# EAGLE design Group11 (EAGLE 9.2.0)
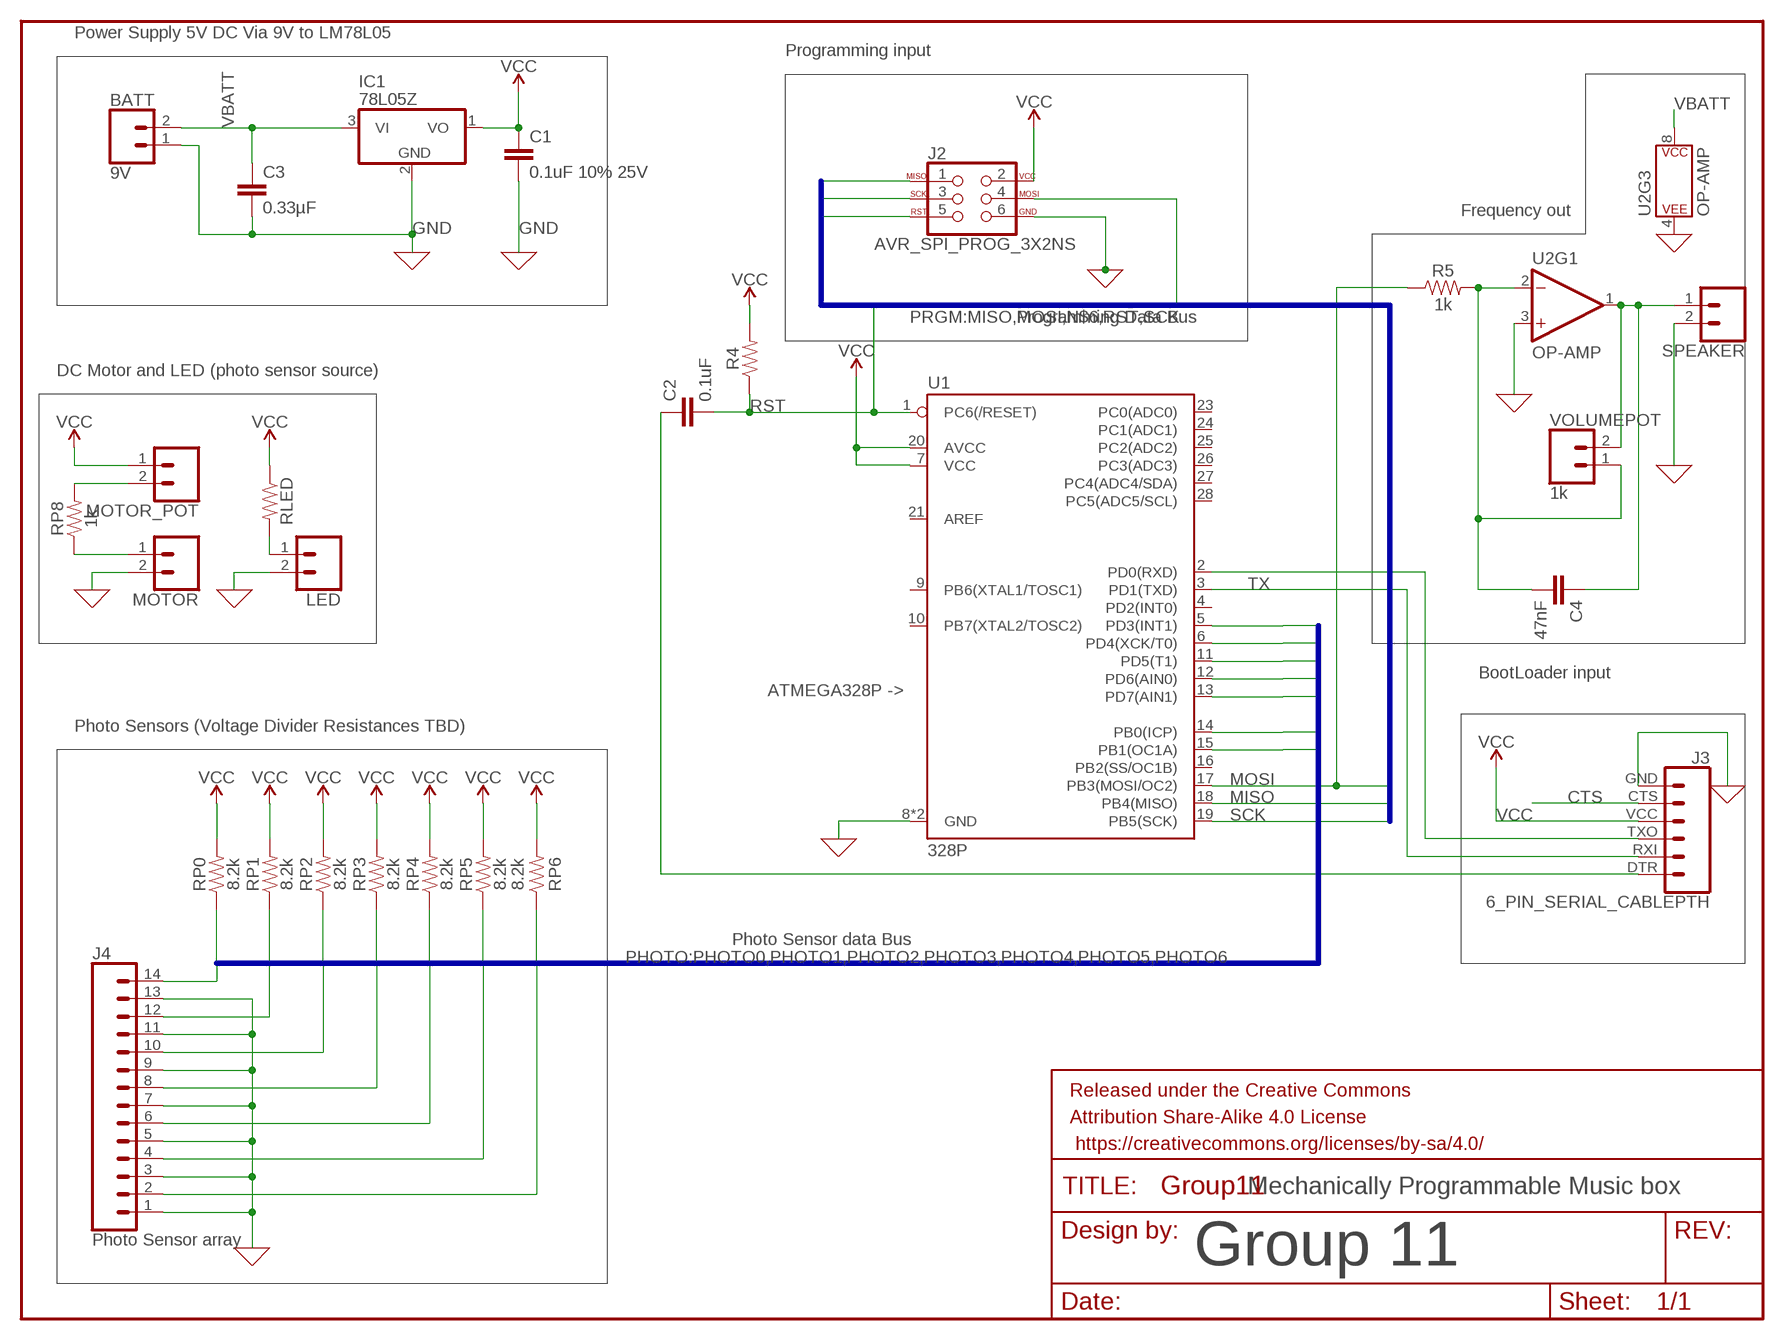
[diagram p0: schematic, sheet 1]

## Parts
BATT  9V  CONN_02  [1X02]
C1  0.1uF 10% 25V  0.1UF-0603-25V-(+80/-20%)  [0603]
C2  0.1uF  0.1UF-0603-25V-(+80/-20%)  [0603]
C3  0.33µF  0.33UF/330NF-0805-50V-10%  [0805]
C4  47nF  47NF-0603-25V-5%  [0603]
FRAME1  FRAME-LETTER  [CREATIVE_COMMONS]
IC1  78L05Z  [TO92]
J2  AVR_SPI_PROG_3X2NS  [2X3-NS]
J3  6_PIN_SERIAL_CABLEPTH  [FTDI_BASIC]
J4  Photo Sensor array  CONN_14  [1X14]
LED  CONN_02  [1X02]
MOTOR  CONN_02  [1X02]
MOTOR_POT  CONN_02  [1X02]
R4  RESISTOR0805  [0805]
R5  1k  1KOHM-0603-1/10W-1%  [0603]
RLED  RESISTOR0603  [0603]
RP0  8.2k  RESISTOR0603  [0603]
RP1  8.2k  RESISTOR0603  [0603]
RP2  8.2k  RESISTOR0603  [0603]
RP3  8.2k  RESISTOR0603  [0603]
RP4  8.2k  RESISTOR0603  [0603]
RP5  8.2k  RESISTOR0603  [0603]
RP6  8.2k  RESISTOR0603  [0603]
RP8  1k  RESISTOR0603  [0603]
SPEAKER  CONN_02  [1X02]
U1  328P  ATMEGA328P_PDIP  [DIP28]
U2  OP-AMP  OPAMP-DUALDIP  [DIP08]
VOLUMEPOT  1k  CONN_02  [1X02]

## Nets
CTS: J3.CTS
GND: BATT.1 C1.2 C3.2 IC1.2(GND) J2.6 J3.GND J4.1 J4.3 J4.5 J4.7 J4.9 J4.11 J4.13 LED.2 MOTOR.2 SPEAKER.2 U1.8(GND) U1.22(GND) U2.3(+IN) U2.4(P$V-)
MISO: J2.1 U1.18(PB4(MISO))
MOSI: J2.4 R5.1 U1.17(PB3(MOSI/OC2))
N$2: MOTOR_POT.2 RP8.2
N$3: LED.1 RLED.2
N$4: J3.TXO U1.2(PD0(RXD))
N$5: C2.1 J3.DTR
N$7: MOTOR.1 RP8.1
N$8: C4.2 R5.2 U2.2(-IN) VOLUMEPOT.1
N$9: C4.1 SPEAKER.1 U2.1(OUT) VOLUMEPOT.2
PHOTO0: J4.14 RP0.1 U1.5(PD3(INT1))
PHOTO1: J4.12 RP1.1 U1.6(PD4(XCK/T0))
PHOTO2: J4.10 RP2.1 U1.11(PD5(T1))
PHOTO3: J4.8 RP3.1 U1.12(PD6(AIN0))
PHOTO4: J4.6 RP4.1 U1.13(PD7(AIN1))
PHOTO5: J4.4 RP5.1 U1.14(PB0(ICP))
PHOTO6: J4.2 RP6.1 U1.15(PB1(OC1A))
RST: C2.2 J2.5 R4.1 U1.1(PC6(/RESET))
SCK: J2.3 U1.19(PB5(SCK))
TX: J3.RXI U1.3(PD1(TXD))
VBATT: BATT.2 C3.1 IC1.3(VI) U2.8(P$V+)
VCC: C1.1 IC1.1(VO) J2.2 J3.VCC MOTOR_POT.1 R4.2 RLED.1 RP0.2 RP1.2 RP2.2 RP3.2 RP4.2 RP5.2 RP6.2 U1.7(VCC) U1.20(AVCC)
Unconnected: U1.4(PD2(INT0)) U1.9(PB6(XTAL1/TOSC1)) U1.10(PB7(XTAL2/TOSC2)) U1.16(PB2(SS/OC1B)) U1.21(AREF) U1.23(PC0(ADC0)) U1.24(PC1(ADC1)) U1.25(PC2(ADC2)) U1.26(PC3(ADC3)) U1.27(PC4(ADC4/SDA)) U1.28(PC5(ADC5/SCL)) U2.5(+IN) U2.6(-IN) U2.7(OUT)

## Buses
PRGM:MISO,MOSI,N$6,RST,SCK
PHOTO:PHOTO0,PHOTO1,PHOTO2,PHOTO3,PHOTO4,PHOTO5,PHOTO6

## Notes on the sheet
- Power Supply 5V DC Via 9V to LM78L05
- Programming input
- Frequency out
- Programming Data Bus
- DC Motor and LED (photo sensor source)
- BootLoader input
- ATMEGA328P ->
- Photo Sensors (Voltage Divider Resistances TBD)
- Photo Sensor data Bus
- Mechanically Programmable Music box
- Group 11

## Library data of the parts
BATT LED MOTOR MOTOR_POT SPEAKER VOLUMEPOT = SparkFun-Connectors:CONN_02: Multi connection point. Often used as Generic Header-pin footprint for 0.1 inch spaced/style header connections On any of the 0.1 inch spaced packages, you can populate with these: Break Away Headers - Straight <https://www.sparkfun.com/products/116> (PRT-00116) Break Away Male Headers - Right Angle <https://www.sparkfun.com/products/553> (PRT-00553) Female Headers <https://www.sparkfun.com/products/115> (PRT-00115) Break Away Headers - Machine Pin <https://www.sparkfun.com/products/117> (PRT-00117) Break Away Female Headers - Swiss Machine Pin <https://www.sparkfun.com/products/743> (PRT-00743) For SCREWTERMINALS and SPRING TERMINALS visit here: Screw Terimnals on SparkFun.com <https://www.sparkfun.com/search/results?term=Screw+Terminals> (5mm/3.5mm/2.54mm spacing) This device is also useful as a general connection point to wire up your design to another part of your project. Our various solder wires solder well into these plated through hole pads. Hook-Up Wire - Assortment (Stranded, 22 AWG) <https://www.sparkfun.com/products/11375> (PRT-11375) Hook-Up Wire - Assortment (Solid Core, 22 AWG) <https://www.sparkfun.com/products/11367> (PRT-11367) View the entire wire category on our website here <https://www.sparkfun.com/categories/141> Special notes: Molex polarized connector foot print use with: PRT-08233 with associated crimp pins and housings. 2.54_SCREWTERM for use with PRT-10571. 3.5mm Screw Terminal footprints for PRT-08084 5mm Screw Terminal footprints for use with PRT-08432
C1 = SparkFun-Capacitors:0.1UF: 0.1µF ceramic capacitors A capacitor is a passive two-terminal electrical component used to store electrical energy temporarily in an electric field.; PROD_ID: CAP-00810; VALUE: 0.1uF
C2 = SparkFun-Capacitors:0.1UF: 0.1µF ceramic capacitors A capacitor is a passive two-terminal electrical component used to store electrical energy temporarily in an electric field.; PROD_ID: CAP-00810
C3 = SparkFun-Capacitors:0.33UF/330NF: 0.33µF/330nF ceramic capacitors A capacitor is a passive two-terminal electrical component used to store electrical energy temporarily in an electric field.; PROD_ID: CAP-08469
C4 = SparkFun-Capacitors:47NF: 47nF ceramic capacitors A capacitor is a passive two-terminal electrical component used to store electrical energy temporarily in an electric field.; PROD_ID: CAP-08605
FRAME1 = SparkFun-Aesthetics:FRAME-LETTER: Schematic Frame - Letter Standard 8.5x11 US Letter frame
IC1 = linear:78*: Positive VOLTAGE REGULATOR Source: http://cache.national.com/ds/LM/LM78L05.pdf http://www.fairchildsemi.com/ds/LM/LM7805.pdf
J2 = SparkFun-Connectors:AVR_SPI_PROG_3X2: AVR ISP 6 Pin This is the reduced ISP connector for AVR programming. Common on Arduino. This footprint will take up less PCB space and can be used with a 10-pin to 6-pin adapter such as SKU: BOB-08508 **Special note about "TEST_POINT" package. The stop mask is on the top side, so if you want your programming test points to be on the bottom of your board, make sure to place this package on the bottom side of the board. This also ensure that the orientation to program from the bottom side will be correct. SparkFun Products: SparkFun ISP Pogo Adapter <https://www.sparkfun.com/products/11591> - NS Tiny AVR Programmer <https://www.sparkfun.com/products/11801> -PTH
J3 = SparkFun-Connectors:6_PIN_SERIAL_CABLE: 6-pin header connection for use with the "FTDI BASIC" pinout - CABLE SIDE. Also known as "Arduino Serial Program Header". This is used on a design to provide a 6-pin connection point for serial communication usually from a USB cable (D+/D-) to these headers (RX/TX). It also has the remaining pins necessary for programming in the Arduino evironment (DTR, GND, and sometimes VCC). Note, this device has "CABLE" in the name. It is intended to be used on a design that usually lives on the end of your USB cable and prvides the converter chip (FTDI232 or FTDI231x) to commnicate serial RX/TX. The "sister" device, named "TARGET" is inteneded to be used on a design that contains a target micro-controller that you wish to program. You can populate with some of these: Female Headers <https://www.sparkfun.com/products/115> (PRT-00115) For reference (or to suit your programming needs) check out these designs: SparkFun FTDI Basic Breakout - 5V <https://www.sparkfun.com/products/9716> (DEV-09716) SparkFun FTDI Basic Breakout - 3.3V <https://www.sparkfun.com/products/9873> (DEV-09873) SparkFun FTDI SmartBasic <https://www.sparkfun.com/products/12935> (DEV-12935) SparkFun Beefy 3 - FTDI Basic Breakout <https://www.sparkfun.com/products/13746> (DEV-13746)
J4 = SparkFun-Connectors:CONN_14: Multi connection point. Often used as Generic Header-pin footprint for 0.1 inch spaced/style header connections On any of the 0.1 inch spaced packages, you can populate with these: Break Away Headers - Straight <https://www.sparkfun.com/products/116> (PRT-00116) Break Away Male Headers - Right Angle <https://www.sparkfun.com/products/553> (PRT-00553) Female Headers <https://www.sparkfun.com/products/115> (PRT-00115) Break Away Headers - Machine Pin <https://www.sparkfun.com/products/117> (PRT-00117) Break Away Female Headers - Swiss Machine Pin <https://www.sparkfun.com/products/743> (PRT-00743) For SCREWTERMINALS and SPRING TERMINALS visit here: Screw Terimnals on SparkFun.com <https://www.sparkfun.com/search/results?term=Screw+Terminals> (5mm/3.5mm/2.54mm spacing) This device is also useful as a general connection point to wire up your design to another part of your project. Our various solder wires solder well into these plated through hole pads. Hook-Up Wire - Assortment (Stranded, 22 AWG) <https://www.sparkfun.com/products/11375> (PRT-11375) Hook-Up Wire - Assortment (Solid Core, 22 AWG) <https://www.sparkfun.com/products/11367> (PRT-11367) View the entire wire category on our website here <https://www.sparkfun.com/categories/141> Special notes: Molex polarized connector foot print use with SKU : PRT-08231 with associated crimp pins and housings. 1MM SMD Version SKU: PRT-10208 NOTES ON THE VARIANTS LOCK and LOCK_LONGPADS... This footprint was designed to help hold the alignment of a through-hole component (i.e. 6-pin header) while soldering it into place. You may notice that each hole has been shifted either up or down by 0.005 of an inch from it's more standard position (which is a perfectly straight line). This slight alteration caused the pins (the squares in the middle) to touch the edges of the holes. Because they are alternating, it causes a "brace" to hold the component in place. 0.005 has proven to be the perfect amount of "off-center" position when using our standard breakaway headers. Although looks a little odd when you look at the bare footprint, once you have a header in there, the alteration is very hard to notice. Also,if you push a header all the way into place, it is covered up entirely on the bottom side.
R4 RLED RP0 RP1-RP6 RP8 = SparkFun-Resistors:RESISTOR: Generic Resistor Package
R5 = SparkFun-Resistors:1KOHM: 1kΩ resistor A resistor is a passive two-terminal electrical component that implements electrical resistance as a circuit element. Resistors act to reduce current flow, and, at the same time, act to lower voltage levels within circuits. - Wikipedia; PROD_ID: RES-07856
U1 = SparkFun-IC-Microcontroller:ATMEGA328P_PDIP: Atmel 328P Through hole ATMEGA328P uC used in the Arduino 32kb flash, 1k EEPROM, 2k SRAM Datasheet <http://www.sparkfun.com/datasheets/Components/SMD/ATMega328.pdf> SparkFun Products Storefront component: AVR 28 Pin 20MHz 32K 6A/D - ATMega328P <https://www.sparkfun.com/products/9061> (COM-09061) SparkFun Simon Says - Through-Hole Soldering Kit <https://www.sparkfun.com/products/10547> (KIT-10547) SparkFun Learn to Solder - Simon Says <https://www.sparkfun.com/products/13708> (KIT-13708) SparkFun BigTime Watch Kit <https://www.sparkfun.com/products/11734> (KIT-11734) SparkFun ClockIt <https://www.sparkfun.com/products/10930> (KIT-10930) SparkFun Serial Enabled LCD Kit <https://www.sparkfun.com/products/10097> (LCD-10097) SparkFun Simon Tilts - Through Hole Soldering Kit <https://www.sparkfun.com/products/12634> (KIT-12634) SparkFun Frequency Counter Kit <https://www.sparkfun.com/products/10140> (KIT-10140) FabFM Radio Kit <https://www.sparkfun.com/products/11043> (KIT-11043) SparkFun Binary Blaster Kit <https://www.sparkfun.com/products/12037> (KIT-12037) SparkFun Metro-Gnome <https://www.sparkfun.com/products/9236> (KIT-09236) ATmega328 with Arduino Optiboot (Uno) <https://www.sparkfun.com/products/10524> (DEV-10524); PROD_ID: IC-09136
U2 = SparkFun-IC-Amplifiers:OPAMP-DUAL: Generic op-amp footprint This component is for the standard 358 pinning of a dual op-amp From the LM358 datasheet: Pin 1: Output A Pin 2: Inverting Input A Pin 3: Non-Inverting Input A Pin 4: Gnd Pin 5: Non-Inverting Input B Pin 6: Inverting Input B Pin 7: Output B Pin 8: V+; PROD_ID: NA-XXXXX

## Board
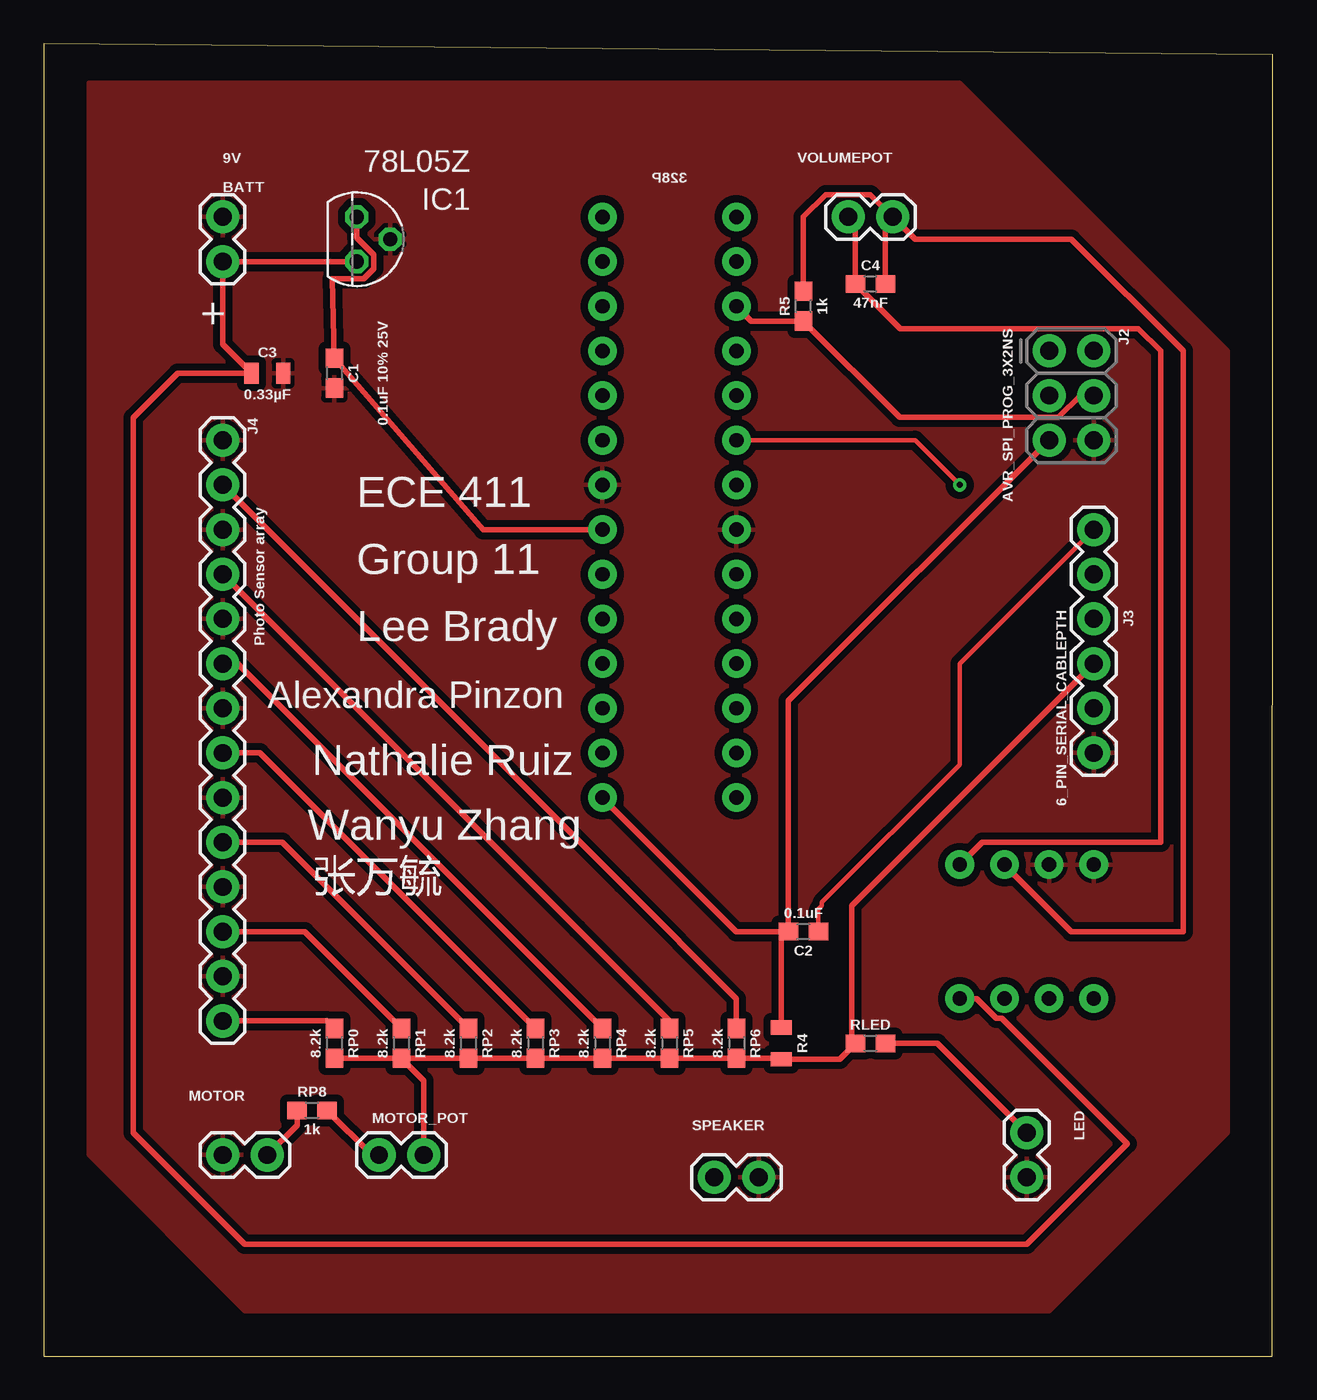
[diagram p1: board, top side]
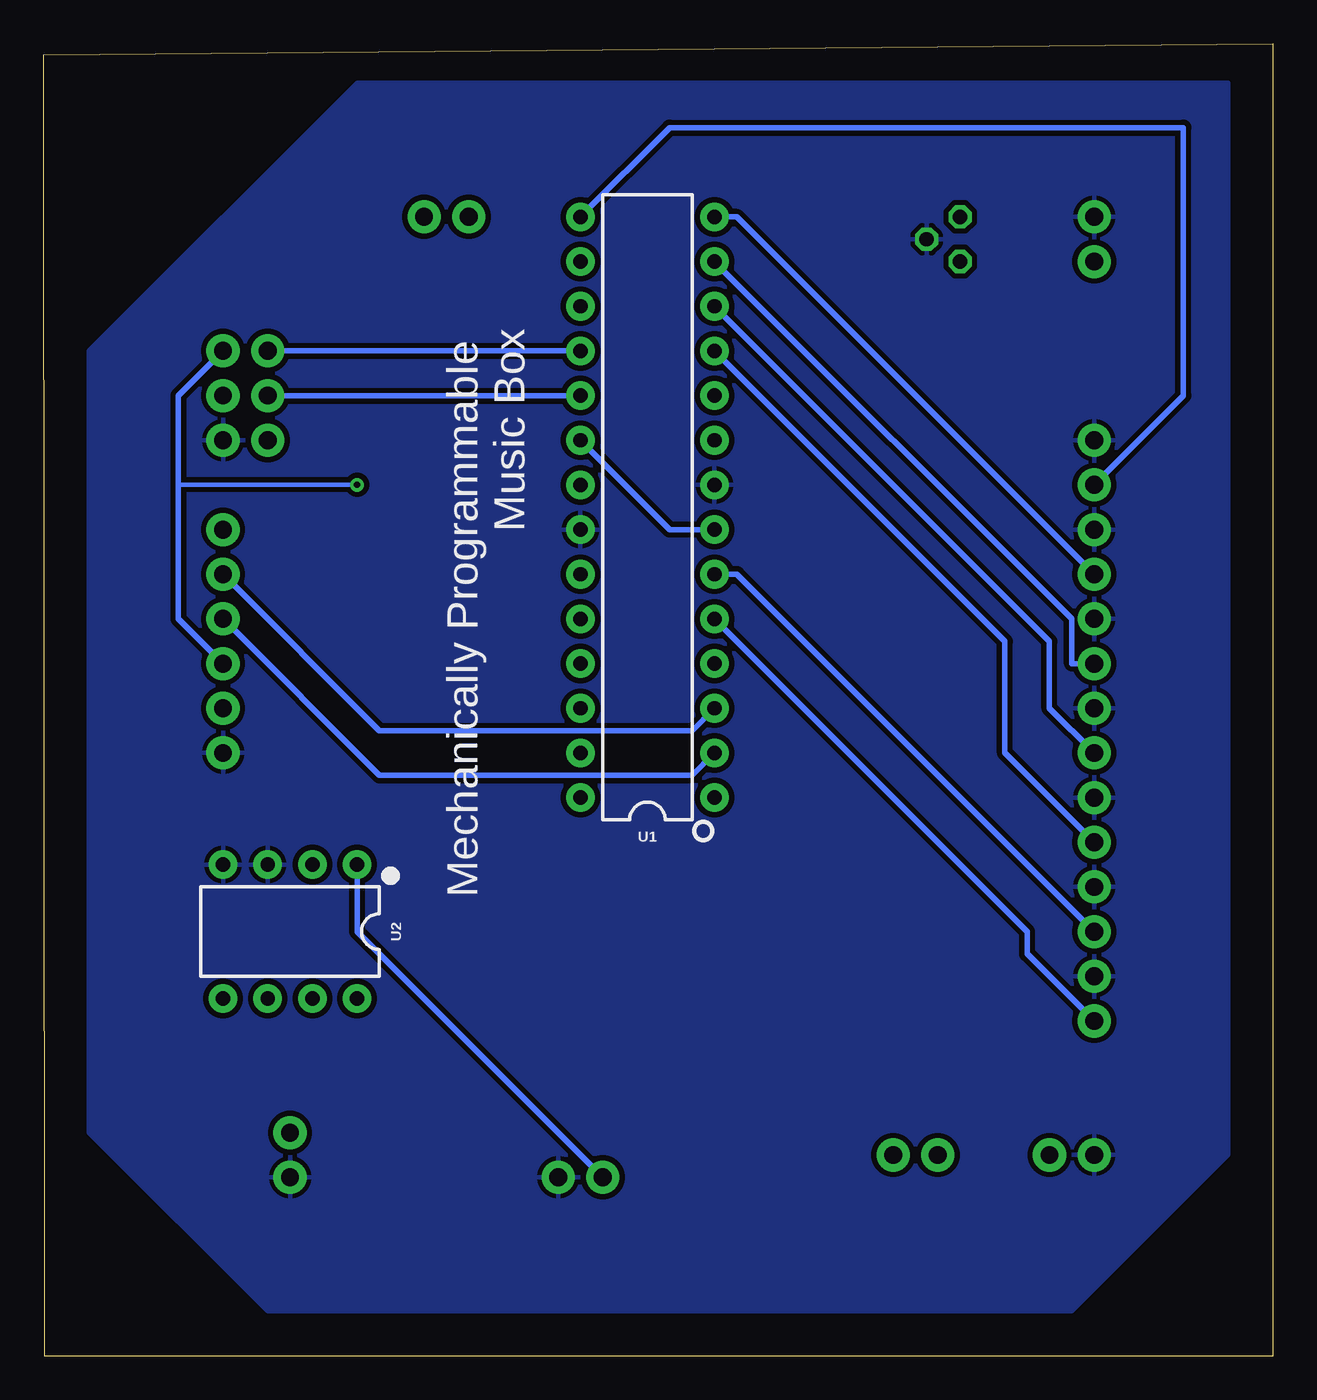
[diagram p2: board, bottom side, seen from below]

Size 69.87 x 74.6 mm. Coordinates in mm from the lower left corner, seen from the top.
Outline: 0,0 69.83,0 69.87,73.99 0,74.6 0,0
Copper layers (1*16): Top 0.035mm / dielectric 1.5mm / Bottom 0.035mm
Design rules "default": minimum track width 6mil, minimum drill 0.35mm, track to track 6mil, track to pad 6mil, pad to pad 6mil, via to via 6mil, smd to smd 6mil, copper to edge 40mil, drill to drill 6mil, minimum pad ring 10mil, minimum via ring 8mil, stop-mask expansion 4mil, vias tented up to drill 0mil, thermal gap 10mil

### Footprints (pad centres in the part's own frame; a part is rotated, then mirrored left to right if it is on the bottom)
1X02 = drill 1.016 pad 1.88: 1 0,0; 2 2.54,0
0603 = smd 1.1 x 1: 1 -0.85,0; 2 0.85,0
0805 = smd 0.8 x 1.2: 1 -0.9,0; 2 0.9,0
TO92 = drill 0.813 octagon: 1 -1.27,0; 2 0,1.905; 3 1.27,0
2X3-NS = drill 1.016 pad 1.88: 1 -2.54,-1.27; 2 -2.54,1.27; 3 0,-1.27; 4 0,1.27; 5 2.54,-1.27; 6 2.54,1.27
FTDI_BASIC = drill 1.016 pad 1.88: CTS 10.16,0; DTR 0,0; GND 12.7,0; RXI 2.54,0; TXO 5.08,0; VCC 7.62,0
1X14 = drill 1.016 pad 1.88: 1 0,0; 2 2.54,0; 3 5.08,0; 4 7.62,0; 5 10.16,0; 6 12.7,0; 7 15.24,0; 8 17.78,0; 9 20.32,0; 10 22.86,0; 11 25.4,0; 12 27.94,0; 13 30.48,0; 14 33.02,0
DIP28 = drill 0.813 pad 1.626: 1 -16.51,-3.81; 2 -13.97,-3.81; 3 -11.43,-3.81; 4 -8.89,-3.81; 5 -6.35,-3.81; 6 -3.81,-3.81; 7 -1.27,-3.81; 8 1.27,-3.81; 9 3.81,-3.81; 10 6.35,-3.81; 11 8.89,-3.81; 12 11.43,-3.81; 13 13.97,-3.81; 14 16.51,-3.81; 15 16.51,3.81; 16 13.97,3.81; 17 11.43,3.81; 18 8.89,3.81; 19 6.35,3.81; 20 3.81,3.81; 21 1.27,3.81; 22 -1.27,3.81; 23 -3.81,3.81; 24 -6.35,3.81; 25 -8.89,3.81; 26 -11.43,3.81; 27 -13.97,3.81; 28 -16.51,3.81
DIP08 = drill 0.813 pad 1.626: 1 -3.81,-3.81; 2 -1.27,-3.81; 3 1.27,-3.81; 4 3.81,-3.81; 5 3.81,3.81; 6 1.27,3.81; 7 -1.27,3.81; 8 -3.81,3.81

### Placement (x,y rotation side)
BATT  10.16,64.77 270 top
C1  16.51,55.88 270 top
C2  43.18,24.13 180 top
C3  12.7,55.88 0 top
C4  46.99,60.96 0 top
FRAME1  -76.2,6.35 0 top  (outside the outline)
IC1  17.78,63.5 270 top
J2  58.42,54.61 270 top
J3  59.69,46.99 270 top
J4  10.16,52.07 270 top
LED  55.88,12.7 270 top
MOTOR  12.7,11.43 180 top
MOTOR_POT  21.59,11.43 180 top
R4  41.91,17.78 270 top
R5  43.18,59.69 90 top
RLED  46.99,17.78 0 top
RP0  16.51,17.78 270 top
RP1  20.32,17.78 270 top
RP2  24.13,17.78 270 top
RP3  27.94,17.78 270 top
RP4  31.75,17.78 270 top
RP5  35.56,17.78 270 top
RP6  39.37,17.78 270 top
RP8  15.24,13.97 0 top
SPEAKER  38.1,10.16 0 top
U1  35.56,48.26 90 bottom
U2  55.88,24.13 180 bottom
VOLUMEPOT  48.26,64.77 180 top

### Tracks (layer width: path | path; a pad name or v marks a point on that pad's centre or on a via)
GND
  pour Top (isolate 0.406): 2.54,72.39 2.54,11.43 11.43,2.54 57.15,2.54 67.31,12.7 67.31,57.15 52.07,72.39
  pour Bottom (isolate 0.305): 2.54,72.39 2.54,11.43 11.43,2.54 57.15,2.54 67.31,12.7 67.31,57.15 52.07,72.39
MISO
  Bottom 0.305: J2.1 U1.18
MOSI
  Top 0.305: J2.4 58.91,54.61 57.67,53.37 48.66,53.37 R5.1 40.22,58.84 U1.17
N$2
  Top 0.305: RP8.2 18.63,11.43 MOTOR_POT.2
N$3
  Top 0.305: LED.1 50.8,17.78 RLED.2
N$4
  Bottom 0.305: J3.TXO 50.8,33.02 33.02,33.02 U1.2
N$5
  Top 0.254: C2.1 44.03,25.4 44.23,25.6 44.23,25.79 52.07,33.63 52.07,39.37 J3.DTR
N$7
  Top 0.305: MOTOR.1 14.39,13.12 RP8.1
N$8
  Top 0.305: C4.2 47.84,64.35 VOLUMEPOT.1 | R5.2 43.18,64.77 44.45,66.04 46.99,66.04 VOLUMEPOT.1 | U2.2 58.42,24.13 64.77,24.13 64.77,57.15 58.42,63.5 49.53,63.5 VOLUMEPOT.1
N$9
  Top 0.305: VOLUMEPOT.2 46.14,64.35 C4.1 48.68,58.42 62.23,58.42 63.5,57.15 63.5,29.21 53.34,29.21 U2.1
  Bottom 0.305: SPEAKER.1 52.07,24.13 U2.1
PHOTO0
  Top 0.305: J4.14 16.09,19.05 RP0.1
  Bottom 0.305: J4.14 13.97,22.86 13.97,24.13 U1.5
PHOTO1
  Top 0.305: J4.12 14.82,24.13 RP1.1
  Bottom 0.305: J4.12 30.48,44.45 U1.6
PHOTO2
  Top 0.305: J4.10 13.55,29.21 RP2.1
  Bottom 0.305: J4.10 15.24,34.29 15.24,40.64 U1.11
PHOTO3
  Top 0.305: J4.8 12.28,34.29 RP3.1
  Bottom 0.305: J4.8 12.7,36.83 12.7,40.64 U1.12
PHOTO4
  Top 0.305: J4.6 11.01,39.37 RP4.1
  Bottom 0.305: J4.6 11.43,39.37 11.43,41.91 U1.13
PHOTO5
  Top 0.305: RP5.1 35.56,19.05 30.33,24.28 J4.4
  Bottom 0.305: J4.4 30.48,64.77 U1.14
PHOTO6
  Top 0.305: RP6.1 39.37,20.32 32.87,26.82 J4.2
  Bottom 0.305: J4.2 5.08,54.61 5.08,69.85 34.29,69.85 U1.15
RST
  Top 0.305: R4.1 41.91,24.13 C2.2 | C2.2 39.37,24.13 U1.1 | C2.2 42.33,37.25 J2.5
SCK
  Bottom 0.305: J2.3 U1.19
TX
  Bottom 0.305: J3.RXI 50.8,35.56 33.02,35.56 U1.3
VBATT
  Top 0.305: IC1.3 BATT.2 10.16,57.52 C3.1 7.62,55.88 5.08,53.34 5.08,12.7 11.43,6.35 55.88,6.35 61.59,12.06 54.46,19.2 54.15,19.2 53.03,20.32 U2.8
VCC  (via drill 0.35)
  Top 0.254: U1.20 49.53,52.07 v52.07,49.53
  Top 0.305: RP0.2 RP1.2 | RP1.2 RP2.2 RP3.2 RP4.2 RP5.2 RP6.2 41.86,16.93 R4.2 45.24,16.88 45.93,17.57 | MOTOR_POT.1 21.59,15.66 RP1.2 | RLED.1 45.93,17.57 | U1.7 24.98,46.99 C1.1 16.39,61.26 18.18,61.26 18.75,61.83 18.75,62.63 17.78,63.59 IC1.1 | J3.VCC 45.93,25.61 45.93,17.57
  Bottom 0.254: v52.07,49.53 62.23,49.53
  Bottom 0.305: U1.7 34.29,46.99 U1.20 | J2.2 62.23,54.61 62.23,49.53 62.23,41.91 J3.VCC

### Text on the board
tPlace: + | ECE 411 | Group 11 | Lee Brady | Alexandra Pinzon | Nathalie Ruiz | Wanyu Zhang
bPlace: Mechanically Programmable / Music Box
bOrigins: C:/Users/Lee/Desktop/waneagle.bmp